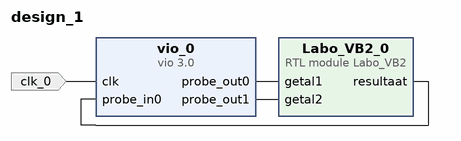
[diagram p0: block diagram of the top level]
# Vivado block design design_1, xc7z020clg400-1, Vivado 2023.1
create_bd_design design_1

create_bd_port -dir I -type clk clk_0

create_bd_cell -type module -reference Labo_VB2 Labo_VB2_0
create_bd_cell -type ip -vlnv xilinx.com:ip:vio:3.0 vio_0
set_property -dict {CONFIG.C_NUM_PROBE_OUT 2 CONFIG.C_PROBE_OUT0_WIDTH 4 CONFIG.C_PROBE_OUT1_WIDTH 4} [get_bd_cells vio_0]

# ---- connections ----

connect_bd_net [get_bd_pins Labo_VB2_0/resultaat] [get_bd_pins vio_0/probe_in0]
connect_bd_net -net clk_0_1 [get_bd_ports clk_0] [get_bd_pins vio_0/clk]
connect_bd_net [get_bd_pins vio_0/probe_out0] [get_bd_pins Labo_VB2_0/getal1]
connect_bd_net [get_bd_pins vio_0/probe_out1] [get_bd_pins Labo_VB2_0/getal2]

validate_bd_design
save_bd_design
